# EAGLE design 2s-module (EAGLE 9.6.2)
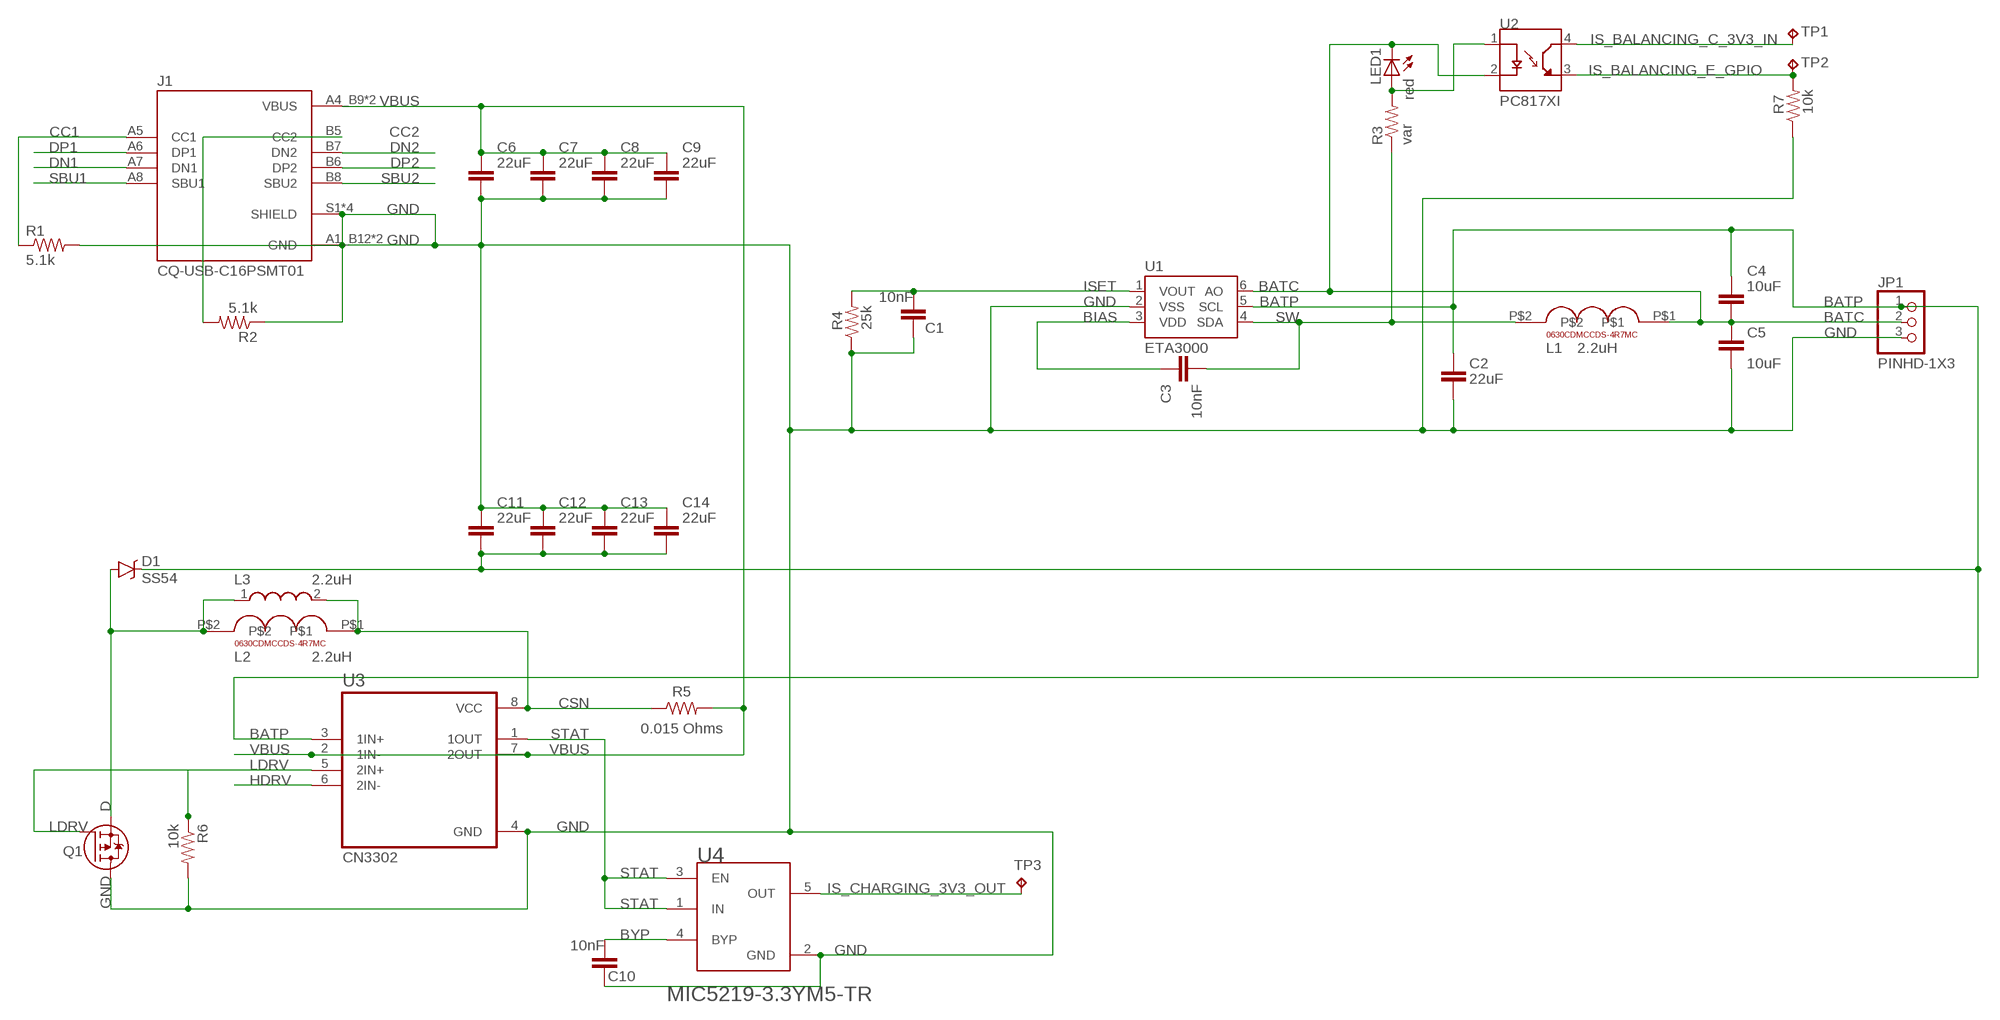
[diagram p0: schematic, sheet 1]

## Parts
C1  10nF  C_CHIP-0603(1608-METRIC)  [CAPC1608X85]
C2  22uF  C_CHIP-1206(3216-METRIC)  [CAPC3216X135]
C3  10nF  C_CHIP-0603(1608-METRIC)  [CAPC1608X85]
C4  10uF  C_CHIP-0603(1608-METRIC)  [CAPC1608X85]
C5  10uF  C_CHIP-0603(1608-METRIC)  [CAPC1608X85]
C6  22uF  C_CHIP-1206(3216-METRIC)  [CAPC3216X135]
C7  22uF  C_CHIP-1206(3216-METRIC)  [CAPC3216X135]
C8  22uF  C_CHIP-1206(3216-METRIC)  [CAPC3216X135]
C9  22uF  C_CHIP-1206(3216-METRIC)  [CAPC3216X135]
C10  10nF  C_CHIP-0603(1608-METRIC)  [CAPC1608X85]
C11  22uF  C_CHIP-1206(3216-METRIC)  [CAPC3216X135]
C12  22uF  C_CHIP-1206(3216-METRIC)  [CAPC3216X135]
C13  22uF  C_CHIP-1206(3216-METRIC)  [CAPC3216X135]
C14  22uF  C_CHIP-1206(3216-METRIC)  [CAPC3216X135]
D1  SS54  [DO-214AC]
J1  CQ-USB-C16PSMT01  [SHENZHEN-CHUANGQIN-TECHNOLOGY_CQ-USB-C16PSMT01]
JP1  PINHD-1X3  [1X03]
L1  0630CDMCCDS-4R7MC  [0630CDMCCDS-4R7MC]
L2  2.2uH  0630CDMCCDS-4R7MC  [0630CDMCCDS-4R7MC]
L3  2.2uH  74437368047  [INDM110100X380N]
LED1  red  LEDCHIPLED_0603  [CHIPLED_0603]
Q1  IRFR9020A  [TO252]
R1  5.1k  R-US_R0603  [R0603]
R2  5.1k  R-US_R0603  [R0603]
R3  var  R-US_R0603  [R0603]
R4  25k  R-US_R0603  [R0603]
R5  0.015 Ohms  R-US_CHIP-2512(6332-METRIC)  [RESC6332X71]
R6  10k  R-US_R0603  [R0603]
R7  10k  R-US_R0603  [R0603]
TP1  TPB1,27  [B1,27]
TP2  TPB1,27  [B1,27]
TP3  TPB1,27  [B1,27]
U1  MCP4725  MCP4725SOT-23  [SOT23-6]
U2  PC817XI  [SOIC254P975X460-4N]
U3  LM393DR  [SOIC127P599X175-8N]
U4  MICROCHIP_MIC5219-3_3YM5-TRMICROCHIP_MIC5219-3_3YM5-TR_0_0  [MICROCHIP_MIC5219-3_3YM5-TR_0]

## Nets
BATC: C4.2 C5.1 JP1.2 L1.P$1 LED1.C U1.6(AO) U2.2(C)
BATP: C2.1 C4.1 C11.2 C12.2 C13.2 C14.2 D1.C JP1.1 U1.5(SCL) U3.3(1IN+)
BIAS: C3.2 U1.3(VDD)
BYP: C10.2 U4.4(BYP)
CC1: J1.A5(CC1) R1.1
CC2: J1.B5(CC2) R2.2
CSN: L2.P$1 L3.2 R5.1 U3.8(VCC)
D: D1.A L2.P$2 L3.1 Q1.2(S)
DN1: J1.A7(DN1)
DN2: J1.B7(DN2)
DP1: J1.A6(DP1)
DP2: J1.B6(DP2)
GND: C1.1 C2.2 C5.2 C6.2 C7.2 C8.2 C9.2 C10.1 C11.1 C12.1 C13.1 C14.1 J1.A1_B12(GND) J1.B1_A12(GND) J1.S1(SHIELD) J1.S2(SHIELD) J1.S3(SHIELD) J1.S4(SHIELD) JP1.3 Q1.3(D) R1.2 R2.1 R4.1 R6.2 R7.1 U1.2(VSS) U3.4(GND) U4.2(GND)
HDRV: U3.6(2IN-)
IS_BALANCING_C_3V3_IN: TP1.TP U2.4(CT)
IS_BALANCING_E_GPIO: R7.2 TP2.TP U2.3(ET)
IS_CHARGING_3V3_OUT: TP3.TP U4.5(OUT)
ISET: C1.2 R4.2 U1.1(VOUT)
LDRV: Q1.1(G) R6.1 U3.5(2IN+)
N$1: LED1.A R3.2 U2.1(A)
SBU1: J1.A8(SBU1)
SBU2: J1.B8(SBU2)
STAT: U3.1(1OUT) U4.1(IN) U4.3(EN)
SW: C3.1 L1.P$2 R3.1 U1.4(SDA)
VBUS: C6.1 C7.1 C8.1 C9.1 J1.A4_B9(VBUS) J1.B4_A9(VBUS) R5.2 U3.2(1IN-) U3.7(2OUT)

## Notes on the sheet
- ETA3000 | L1 | 2.2uH
- L2 | 2.2uH
- CN3302

## Library data of the parts
C1-C14 = Capacitor:C: Capacitor - Generic; CATEGORY: Capacitor
D1 = SS54:SS54: SCHOTTKY DIODES 40Vpeak, 28Vrms 5A (SBD) SMA(DO-214AC) Check availability <https://pricing.snapeda.com/parts/SS54/MDD/view-part?ref=eda>; AVAILABILITY: In Stock; CHECK_PRICES: https://www.snapeda.com/parts/SS54/MDD/view-part/?ref=eda; DESCRIPTION: Diode Schottky 40 V 5A Surface Mount SMA; MF: MDD; MP: SS54; PACKAGE: None; PRICE: None; PURCHASE-URL: https://www.snapeda.com/api/url_track_click_mouser/?unipart_id=12137997&manufacturer=MDD&part_name=SS54&search_term=None; SNAPEDA_LINK: https://www.snapeda.com/parts/SS54/MDD/view-part/?ref=snap
J1 = CQ-USB-C16PSMT01:CQ-USB-C16PSMT01: C Type USB Type-C Female Plug 16 Pin Connector Power Charger Jack Port Check availability <https://pricing.snapeda.com/parts/CQ-USB-C16PSMT01/Shenzen%20Chuangqin%20Technology/view-part?ref=eda>; AVAILABILITY: Not in stock; DESCRIPTION: C Type USB Type-C Female Plug 16 Pin Connector Power Charger Jack Port; MF: Shenzen Chuangqin Technology; MP: CQ-USB-C16PSMT01; PACKAGE: Package; PRICE: None
JP1 = Connector:PINHD-1X3: PIN HEADER; CATEGORY: Headers; DESCRIPTION: Header, Straight, 3 Position; MANUFACTURER: Generic; MPN: Generic; OPERATING_TEMPERATURE: Generic; PART_STATUS: Active; PITCH: 0.100" (2.54mm); ROHS_COMPLIANCE: Generic; SERIES: Generic; SUB-CATEGORY: Headers, Male Pins; TYPE: Board to Board or Cable, Unshrouded, Through Hole, Straight
L1 L2 = 0630CDMCCDS-4R7MC:0630CDMCCDS-4R7MC: Check availability <https://pricing.snapeda.com/parts/0630CDMCCDS-4R7MC/Sumida/view-part?ref=eda>; AVAILABILITY: In Stock; CHECK_PRICES: https://www.snapeda.com/parts/0630CDMCCDS-4R7MC/Sumida/view-part/?ref=eda; DESCRIPTION: 4.7 µH Shielded Molded Inductor 6.3 A 33mOhm Max Nonstandard; MF: Sumida; MP: 0630CDMCCDS-4R7MC; PACKAGE: Nonstandard Sumida; PRICE: None; PURCHASE-URL: https://www.snapeda.com/api/url_track_click_mouser/?unipart_id=1647434&manufacturer=Sumida&part_name=0630CDMCCDS-4R7MC&search_term=0630; SNAPEDA_LINK: https://www.snapeda.com/parts/0630CDMCCDS-4R7MC/Sumida/view-part/?ref=snap
L3 = 74437368047:74437368047: LHMI Inductor 1040 4.7uH 7.0A 15.5mOhm Check availability <https://pricing.snapeda.com/parts/74437368047/Wurth%20Electronics/view-part?ref=eda>; AVAILABILITY: In Stock; CHECK_PRICES: https://www.snapeda.com/parts/74437368047/Wurth+Electronics+Inc./view-part/?ref=eda; DESCRIPTION: 4.7 µH Shielded Molded Inductor 7 A 15.5mOhm Max Nonstandard; MF: Wurth Electronics; MP: 74437368047; PACKAGE: Nonstandard Wurth Electronics; PRICE: None; SNAPEDA_LINK: https://www.snapeda.com/parts/74437368047/Wurth+Electronics+Inc./view-part/?ref=snap
LED1 = adafruit:LED: LED OSRAM: - CHIPLED LG R971, LG N971, LY N971, LG Q971, LY Q971, LO R971, LY R971 LH N974, LH R974 LS Q976, LO Q976, LY Q976 LO Q996 - Hyper CHIPLED LW Q18S LB Q993, LB Q99A, LB R99A - SideLED LS A670, LO A670, LY A670, LG A670, LP A670 LB A673, LV A673, LT A673, LW A673 LH A674 LY A675 LS A676, LA A676, LO A676, LY A676, LW A676 LS A679, LY A679, LG A679 - Hyper Micro SIDELED® LS Y876, LA Y876, LO Y876, LY Y876 LT Y87S - SmartLED LW L88C, LW L88S LB L89C, LB L89S, LG L890 LS L89K, LO L89K, LY L89K LS L896, LA L896, LO L896, LY L896 - TOPLED LS T670, LO T670, LY T670, LG T670, LP T670 LSG T670, LSP T670, LSY T670, LOP T670, LYG T670 LG T671, LOG T671, LSG T671 LB T673, LV T673, LT T673, LW T673 LH T674 LS T676, LA T676, LO T676, LY T676, LB T676, LH T676, LSB T676, LW T676 LB T67C, LV T67C, LT T67C, LS T67K, LO T67K, LY T67K, LW E67C LS E67B, LA E67B, LO E67B, LY E67B, LB E67C, LV E67C, LT E67C LW T67C LS T679, LY T679, LG T679 LS T770, LO T770, LY T770, LG T770, LP T770 LB T773, LV T773, LT T773, LW T773 LH T774 LS E675, LA E675, LY E675, LS T675 LS T776, LA T776, LO T776, LY T776, LB T776 LHGB T686 LT T68C, LB T68C - Hyper Mini TOPLED® LB M676 - Mini TOPLED Santana® LG M470 LS M47K, LO M47K, LY M47K Source: http://www.osram.convergy.de/
Q1 = semiconductor:IRFR9020: P-Channel FET IRFR9020A 50V 9.9A 0.28ohm 42W -50 to 150°C TO252 / DPAK SMD
R1-R4 R6 R7 = resistor:R-US_: RESISTOR, American symbol
R5 = Resistor:R-US: Resistor Fixed - ANSI; CATEGORY: Resistor; SUB-CATEGORY: Fixed
TP1-TP3 = BeagleBone_Blue_R3:TP: Test pad
U1 = SparkFun-IC-Conversion:MCP4725: MCP4725 DAC Microchip 12-bit I2C DAC, SOT23-6 Datasheet <https://cdn.sparkfun.com/datasheets/BreakoutBoards/MCP4725_2009.pdf> SparkFun Products SparkFun I2C DAC Breakout - MCP4725 <https://www.sparkfun.com/products/12918> (BOB-12918); PROD_ID: IC-08886
U2 = PC817XI:PC817XI: Semiconductors and Actives, Optocouplers/Optoisolators, trans, Optoelectronics, smd Check availability <https://pricing.snapeda.com/parts/PC817XI/Sharp%20Microelectronics/view-part?ref=eda>; AVAILABILITY: In Stock; CHECK_PRICES: https://www.snapeda.com/parts/PC817XI/Sharp+Microelectronics/view-part/?ref=eda; DESCRIPTION: Optoisolator Transistor Output 5000Vrms 1 Channel 4-SMD; MF: Sharp Microelectronics; MP: PC817XI; PACKAGE: SMD-4 Sharp Microelectronics; PRICE: None; PURCHASE-URL: https://www.snapeda.com/api/url_track_click_mouser/?unipart_id=494182&manufacturer=Sharp Microelectronics&part_name=PC817XI&search_term=pc817; SNAPEDA_LINK: https://www.snapeda.com/parts/PC817XI/Sharp+Microelectronics/view-part/?ref=snap
U3 = LM393DR:LM393DR: Check availability <https://pricing.snapeda.com/parts/LM393DR/Texas%20Instruments/view-part?ref=eda>; AVAILABILITY: In Stock; CHECK_PRICES: https://www.snapeda.com/parts/LM393DR/Texas+Instruments/view-part/?ref=eda; DESCRIPTION: Dual differential comparator, commercial grade; MF: Texas Instruments; MP: LM393DR; PACKAGE: SOIC-8 Texas Instruments; PRICE: None; PURCHASE-URL: https://www.snapeda.com/api/url_track_click_mouser/?unipart_id=6437&manufacturer=Texas Instruments&part_name=LM393DR&search_term=lm393dr; SNAPEDA_LINK: https://www.snapeda.com/parts/LM393DR/Texas+Instruments/view-part/?ref=snap
U4 = Microchip - MIC5219-3.3YM5-TR:MICROCHIP_MIC5219-3_3YM5-TR: MIC5219-3.3YM5-TR Linear Voltage Regulator IC 1 Output 500mA SOT-23-5; ACCURACY_PERCENTAGE: 1%; AMBIENT_TEMPERATURE_RANGE_HIGH: +125°C; AMBIENT_TEMPERATURE_RANGE_LOW: -40°C; AUTOMOTIVE: No; CENTROID_NOT_SPECIFIED: No; DATASHEET: http://ww1.microchip.com/downloads/en/DeviceDoc/MIC5219-500mA-Peak-Output-LDO-Regulator-DS20006021A.pdf; DEVICE_CLASS_L1: Integrated Circuits (ICs); DEVICE_CLASS_L2: Power Management ICs; DEVICE_CLASS_L3: Voltage Regulators - Linear; DIGIKEY_DESCRIPTION: IC REG LINEAR 3.3V 500MA SOT23-5; DIGIKEY_PART_NUMBER: 576-1281-1-ND; DROPOUT_VOLTAGE: 350mV; FOOTPRINT_PARAMETERS_1: {"fp_type":"SOT23","params":{"N":{"default":"5","long name":"Number of leads","type":"multichoice","short name":"N"},"A":{"nom":false,"long name":"Height","min":900000,"max":1450000,"short name":"A","type":"measurement"},"A1":{"nom":false,"long name":"Package clearance","min":0,"max":150000,"short name":"A1","type":"measurement"},"A2":{"nom":1100000,"long name":"Package height","min":900000,"max":1300000,"short name":"A2","type":"measurement"},"D":{"nom":2900000,"long name":"Package length","min":2800000,"max":3000000,"short name":"D","type":"measurement"},"E":{"nom":2800000,"long name":"Width /w leads","min":2600000,"max":3000000,"short name":"E","type":"measurement"},"E1":{"nom":1600000,"long name":"Package width","min":1500000,"max":1700000,"short name":"E1","type":"measurement"},"B":{"nom":false,"long name":"Lead width","min":250000,"max":500000,"short name":"B","type":"measurement"},"C":{"nom":false,"long name":"Lead thickness","min":90000,"max":200000,"short name":"C","type":"measurement"},"L":{"nom":450000,"long name":"Lead foot length","min":350000,"max":550000,"short name":"L","type":"measurement"},"e":{"nom":950000,"long name":"Lead pitch","min":null,"max":null,"short name":"e","type":"measurement"},"PHI":{"nom":false,"long name":"Lead angle","min":0,"max":3000000,"short name":"PHI","type":"measurement"},"offset x":{"nom":0,"long name":"X Center offset","min":null,"max":null,"short name":"offset x","type":"measurement"},"offset y":{"nom":0,"long name":"Y Center offset","min":null,"max":null,"short name":"offset y","type":"measurement"},"LS":{"default":"Rounded rectangle","long name":"Land shape","type":"multichoice","short name":"LS"},"LS1":{"default":"Rectangle","long name":"Land shape (Pin 1)","type":"multichoice","short name":"LS1"},"solder toe":{"nom":550000,"long name":"Solder fillet (toe)","min":null,"max":null,"short name":"solder toe","type":"fixedmeasurement"},"solder heel":{"nom":450000,"long name":"Solder fillet (heel)","min":null,"max":null,"short name":"solder heel","type":"fixedmeasurement"},"solder side":{"nom":50000,"long name":"Solder fillet (side)","min":null,"max":null,"short name":"solder side","type":"fixedmeasurement"},"courtyard":{"nom":500000,"long name":"Courtyard","min":null,"max":null,"short name":"courtyard","type":"fixedmeasurement"},"SF":{"default":"A","long name":"Packing level","type":"multichoiceparent","short name":"SF","help":"http://support.upverter.com/customer/portal/articles/978783-what-is-a-footprint-packing-level","children":["solder toe","solder heel","solder side","courtyard"]}}}; FOOTPRINT_PARAMETERS_2: {"fp_type":"SOT23","params":{"N":{"default":"5","long name":"Number of leads","type":"multichoice","short name":"N"},"A":{"nom":false,"long name":"Height","min":900000,"max":1450000,"short name":"A","type":"measurement"},"A1":{"nom":false,"long name":"Package clearance","min":0,"max":150000,"short name":"A1","type":"measurement"},"A2":{"nom":1100000,"long name":"Package height","min":900000,"max":1300000,"short name":"A2","type":"measurement"},"D":{"nom":2900000,"long name":"Package length","min":2800000,"max":3000000,"short name":"D","type":"measurement"},"E":{"nom":2800000,"long name":"Width /w leads","min":2600000,"max":3000000,"short name":"E","type":"measurement"},"E1":{"nom":1600000,"long name":"Package width","min":1500000,"max":1700000,"short name":"E1","type":"measurement"},"B":{"nom":false,"long name":"Lead width","min":250000,"max":500000,"short name":"B","type":"measurement"},"C":{"nom":false,"long name":"Lead thickness","min":90000,"max":200000,"short name":"C","type":"measurement"},"L":{"nom":450000,"long name":"Lead foot length","min":350000,"max":550000,"short name":"L","type":"measurement"},"e":{"nom":950000,"long name":"Lead pitch","min":null,"max":null,"short name":"e","type":"measurement"},"PHI":{"nom":false,"long name":"Lead angle","min":0,"max":3000000,"short name":"PHI","type":"measurement"},"offset x":{"nom":0,"long name":"X Center offset","min":null,"max":null,"short name":"offset x","type":"measurement"},"offset y":{"nom":0,"long name":"Y Center offset","min":null,"max":null,"short name":"offset y","type":"measurement"},"LS":{"default":"Rounded rectangle","long name":"Land shape","type":"multichoice","short name":"LS"},"LS1":{"default":"Rectangle","long name":"Land shape (Pin 1)","type":"multichoice","short name":"LS1"},"solder toe":{"nom":350000,"long name":"Solder fillet (toe)","min":null,"max":null,"short name":"solder toe","type":"fixedmeasurement"},"solder heel":{"nom":350000,"long name":"Solder fillet (heel)","min":null,"max":null,"short name":"solder heel","type":"fixedmeasurement"},"solder side":{"nom":30000,"long name":"Solder fillet (side)","min":null,"max":null,"short name":"solder side","type":"fixedmeasurement"},"courtyard":{"nom":250000,"long name":"Courtyard","min":null,"max":null,"short name":"courtyard","type":"fixedmeasurement"},"SF":{"default":"B","long name":"Packing level","type":"multichoiceparent","short name":"SF","help":"http://support.upverter.com/customer/portal/articles/978783-what-is-a-footprint-packing-level","children":["solder toe","solder heel","solder side","courtyard"]}}}; FOOTPRINT_PARAMETERS_3: {"fp_type":"SOT23","params":{"N":{"default":"5","long name":"Number of leads","type":"multichoice","short name":"N"},"A":{"nom":false,"long name":"Height","min":900000,"max":1450000,"short name":"A","type":"measurement"},"A1":{"nom":false,"long name":"Package clearance","min":0,"max":150000,"short name":"A1","type":"measurement"},"A2":{"nom":1100000,"long name":"Package height","min":900000,"max":1300000,"short name":"A2","type":"measurement"},"D":{"nom":2900000,"long name":"Package length","min":2800000,"max":3000000,"short name":"D","type":"measurement"},"E":{"nom":2800000,"long name":"Width /w leads","min":2600000,"max":3000000,"short name":"E","type":"measurement"},"E1":{"nom":1600000,"long name":"Package width","min":1500000,"max":1700000,"short name":"E1","type":"measurement"},"B":{"nom":false,"long name":"Lead width","min":250000,"max":500000,"short name":"B","type":"measurement"},"C":{"nom":false,"long name":"Lead thickness","min":90000,"max":200000,"short name":"C","type":"measurement"},"L":{"nom":450000,"long name":"Lead foot length","min":350000,"max":550000,"short name":"L","type":"measurement"},"e":{"nom":950000,"long name":"Lead pitch","min":null,"max":null,"short name":"e","type":"measurement"},"PHI":{"nom":false,"long name":"Lead angle","min":0,"max":3000000,"short name":"PHI","type":"measurement"},"offset x":{"nom":0,"long name":"X Center offset","min":null,"max":null,"short name":"offset x","type":"measurement"},"offset y":{"nom":0,"long name":"Y Center offset","min":null,"max":null,"short name":"offset y","type":"measurement"},"LS":{"default":"Rounded rectangle","long name":"Land shape","type":"multichoice","short name":"LS"},"LS1":{"default":"Rectangle","long name":"Land shape (Pin 1)","type":"multichoice","short name":"LS1"},"solder toe":{"nom":150000,"long name":"Solder fillet (toe)","min":null,"max":null,"short name":"solder toe","type":"fixedmeasurement"},"solder heel":{"nom":250000,"long name":"Solder fillet (heel)","min":null,"max":null,"short name":"solder heel","type":"fixedmeasurement"},"solder side":{"nom":10000,"long name":"Solder fillet (side)","min":null,"max":null,"short name":"solder side","type":"fixedmeasurement"},"courtyard":{"nom":100000,"long name":"Courtyard","min":null,"max":null,"short name":"courtyard","type":"fixedmeasurement"},"SF":{"default":"C","long name":"Packing level","type":"multichoiceparent","short name":"SF","help":"http://support.upverter.com/customer/portal/articles/978783-what-is-a-footprint-packing-level","children":["solder toe","solder heel","solder side","courtyard"]}}}; FOOTPRINT_VARIANT_NAME_0: Recommended_Land_Pattern; FOOTPRINT_VARIANT_NAME_1: IPC_A; FOOTPRINT_VARIANT_NAME_2: IPC_B; FOOTPRINT_VARIANT_NAME_3: IPC_C; HEIGHT: 1.45mm; LEAD_FREE: yes; MAX_JUNCTION_TEMP: +125°C; MAX_SUPPLY_VOLTAGE: 12V; MF: Microchip; MFG_PACKAGE_IDENT: SOT23-5LD-PL-1; MFG_PACKAGE_IDENT_COMPONENT_ID: 354a25971f54c3a5; MFG_PACKAGE_IDENT_DATE: 0; MFG_PACKAGE_IDENT_REV: 0; MIN_SUPPLY_VOLTAGE: 2.5V; MOUSER_PART_NUMBER: 998-MIC5219-3.3YM5TR; MPN: MIC5219-3.3YM5-TR; NOMINAL_SUPPLY_CURRENT: 0.1-12000uA; NUMBER_OF_OUTPUTS: 1; OUTPUT_CURRENT: 500mA; OUTPUT_TYPE: Fixed; OUTPUT_VOLTAGE: 3.3V; PACKAGE: SOT-23-5; PREFIX: U; ROHS: Yes; STANDOFF_HEIGHT: 0mm; TEMPERATURE_RANGE_HIGH: +125°C; TEMPERATURE_RANGE_LOW: -40°C; VERIFICATION_VERSION: 0.0.0.3

## Board
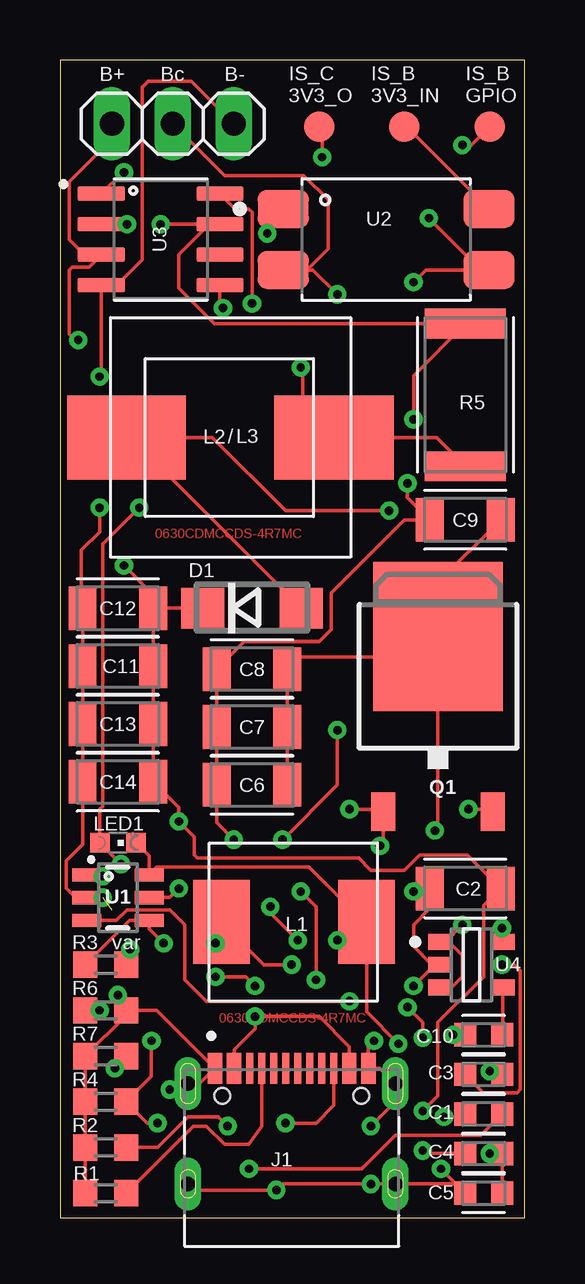
[diagram p1: board, top side]
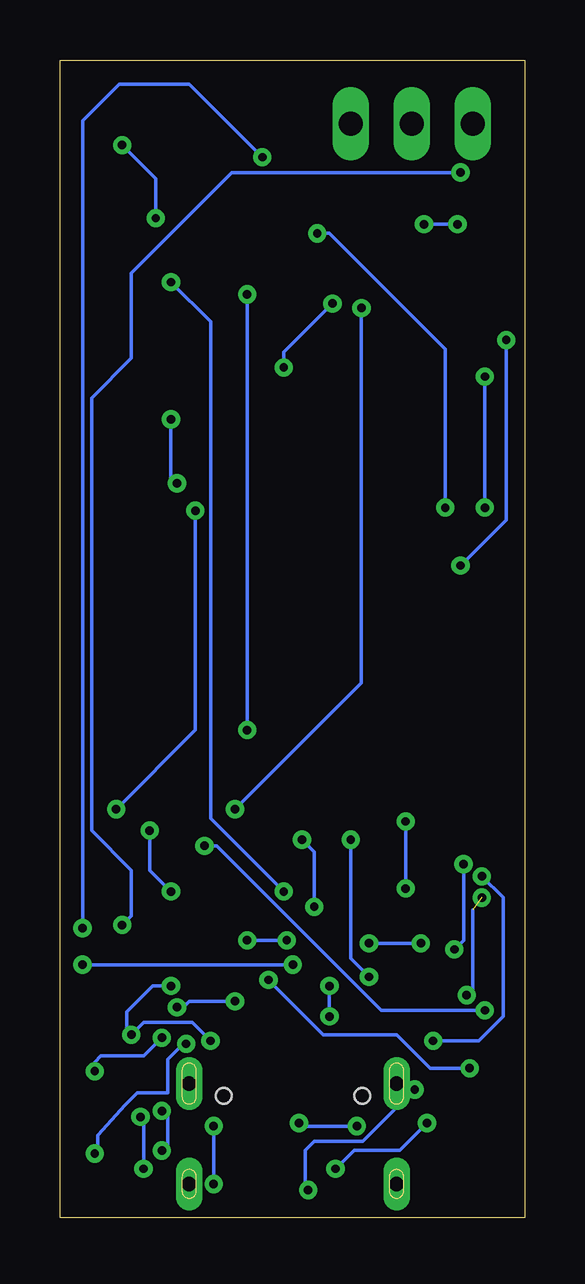
[diagram p2: board, bottom side, seen from below]

Size 19.36 x 48.25 mm. Coordinates in mm from the lower left corner, seen from the top.
Outline: 0,0 19.36,0 19.36,48.25 0,48.25 0,0
Copper layers (1*16): Top 0.035mm / dielectric 1.5mm / Bottom 0.035mm
Design rules "default *": minimum track width 6mil, minimum drill 0.35mm, track to track 6mil, track to pad 6mil, pad to pad 6mil, via to via 6mil, smd to smd 6mil, copper to edge 40mil, drill to drill 6mil, minimum pad ring 10mil, minimum via ring 8mil, stop-mask expansion 4mil, vias tented up to drill 20mil, thermal gap 10mil

### Footprints (pad centres in the part's own frame; a part is rotated, then mirrored left to right if it is on the bottom)
CAPC1608X85 = smd 0.921 x 0.97: 1 -0.775,0; 2 0.775,0
CAPC3216X135 = smd 1.165 x 1.815: 1 -1.475,0; 2 1.475,0
DO-214AC = smd 1.8 x 1.7: A 2.05,0; C -2.05,0
SHENZHEN-CHUANGQIN-TECHNOLOGY_CQ-USB-C16PSMT01 = smd 0.6 x 1.3: A1_B12 -3.2,0; A4_B9 -2.4,0; B1_A12 3.2,0; B4_A9 2.4,0 | smd 0.3 x 1.3: A5 -1.25,0; A6 -0.25,0; A7 0.25,0; A8 1.25,0; B5 1.75,0; B6 0.75,0; B7 -0.75,0; B8 -1.75,0 | drill 0.6 pad 1.05 long: S1 -4.32,-0.64; S2 4.32,-0.64 | drill 0.6 pad 0.8 long: S3 -4.32,-4.82; S4 4.32,-4.82 | hole 0.65: -2.89,-1.14; 2.89,-1.14
1X03 = drill 1.016 long: 1 -2.54,0; 2 0,0; 3 2.54,0
0630CDMCCDS-4R7MC = smd 2.35 x 3.5: P$1 6.55,3.3; P$2 0.5,3.3
INDM110100X380N = smd 4.1 x 3.5: 1 -4.75,0; 2 4.75,0
CHIPLED_0603 = smd 0.8 x 0.8: A 0,-0.75; C 0,0.75
TO252 = smd 1 x 1.6: 1 -2.28,-4.8; 2 2.28,-4.8 | smd 5.4 x 6.2: 3 0,2.5
R0603 = smd 1 x 1.1: 1 -0.85,0; 2 0.85,0
RESC6332X71 = smd 1.231 x 3.37: 1 -2.97,0; 2 2.97,0
B1,27 = smd 1.27 x 1.27: TP 0,0
SOT23-6 = smd 0.55 x 1.2: 1 0.95,1.3; 2 0,1.3; 3 -0.95,1.3; 4 -0.95,-1.3; 5 0,-1.3; 6 0.95,-1.3
SOIC254P975X460-4N = smd 2.13 x 1.57: 1 -4.29,1.27; 2 -4.29,-1.27; 3 4.29,-1.27; 4 4.29,1.27
SOIC127P599X175-8N = smd 1.97 x 0.6: 1 -2.47,1.905; 2 -2.47,0.635; 3 -2.47,-0.635; 4 -2.47,-1.905; 5 2.47,-1.905; 6 2.47,-0.635; 7 2.47,0.635; 8 2.47,1.905
MICROCHIP_MIC5219-3_3YM5-TR_0 = smd 1 x 0.66: 1 -1.3,0.95; 2 -1.3,0; 3 -1.3,-0.95; 4 1.3,-0.95; 5 1.3,0.95

### Placement (x,y rotation side)
C1  17.65,4.32 0 top
C2  16.89,13.72 180 top
C3  17.65,5.97 0 top
C4  17.65,2.67 0 top
C5  17.65,1.02 180 top
C6  8,18.03 0 top
C7  8,20.45 0 top
C8  8,22.86 0 top
C9  16.89,29.08 0 top
C10  17.65,7.62 0 top
C11  2.41,22.99 0 top
C12  2.41,25.4 0 top
C13  2.41,20.57 0 top
C14  2.41,18.16 0 top
D1  8,25.4 0 top
J1  9.65,6.22 0 top
JP1  4.7,45.59 0 top
L1  6.22,9.02 0 top
L2  3.56,29.21 0 top
L3  7.11,32.51 0 top
LED1  2.41,15.62 270 top
Q1  15.75,21.72 0 top
R1  1.9,1.02 180 top
R2  1.9,2.92 0 top
R3  1.9,10.54 0 top
R4  1.9,4.83 0 top
R5  16.89,34.29 90 top
R6  1.9,8.64 0 top
R7  1.9,6.73 0 top
TP1  14.35,45.47 0 top
TP2  17.91,45.47 0 top
TP3  10.79,45.47 0 top
U1  2.41,13.34 90 top
U2  13.59,40.77 0 top
U3  4.19,40.77 0 top
U4  17.14,10.54 0 top

### Tracks (layer width: path | path; a pad name or v marks a point on that pad's centre or on a via)
BATC  (via drill 0.35)
  Top 0.152: JP1.2 6.86,43.43 10.16,43.43 11.18,42.42 11.18,40.39 10.29,39.5 U2.2 10.54,39.5 v11.56,38.48 | L1.P$1 12.77,12.19 | 12.77,12.19 12.77,8.56 v14.1,7.24 | v17.91,2.67 C4.2 C5.1 | 12.67,12.29 10.36,14.61 4.03,14.61 U1.6 3.71,15.07 LED1.C | 12.67,12.29 12.77,12.19 | v11.56,20.32 11.56,18.03 v9.27,15.75 | v8.76,12.95 8.76,12.7 v9.91,11.56 | v11.56,11.56 11.94,11.56 12.67,12.29
  Bottom 0.152: v17.91,2.67 17.78,2.67 17.78,3.43 16.64,4.7 16.13,5.21 14.86,5.21 14.86,6.6 14.22,7.24 v14.1,7.24 | v11.56,38.48 v11.56,20.32 | v9.27,15.75 8.76,15.24 v8.76,12.95 | v9.91,11.56 v11.56,11.56
BATP  (via drill 0.35)
  Top 0.152: C4.1 15.24,2.67 v15.11,2.79 | v15.11,4.45 15.75,5.08 15.75,8.13 17.65,10.03 17.65,13 C2.1 16.97,15.11 14.99,15.11 14.35,14.48 12.95,14.48 12.45,14.99 5.71,14.99 5.59,15.11 5.59,15.88 v4.95,16.51 4.95,17.1 C14.2 C13.2 C11.2 C12.2 | JP1.1 2.16,44.96 0.38,43.18 0.38,40.77 1.02,40.13 U3.3 1.21,39.62 0.51,39.62 0.38,39.5 0.38,36.83 0.64,36.58 v0.76,36.58 | v2.67,27.18 3.89,25.96 C12.2 | C12.2 D1.C | v4.95,13.72 4.57,13.34 U1.5
  Bottom 0.152: v15.11,4.45 14.86,4.19 14.86,3.05 v15.11,2.79 | v0.76,36.58 0.76,29.08 v2.67,27.18 | v4.95,13.72 v4.95,16.51
BIAS  (via drill 0.35)
  Top 0.152: U1.3 2.35,12.38 2.79,12.83 4.57,12.83 5.21,12.19 5.21,9.91 6.1,9.02 v12.07,9.02 | v14.48,8.76 15.11,8.13 v15.11,7.49 | v17.91,6.1 18.3,6.1 C3.2
  Bottom 0.152: v12.07,9.02 13.97,9.02 14.35,8.64 v14.48,8.76 | v15.11,7.49 15.88,6.73 17.65,6.73 17.91,6.48 v17.91,6.1
BYP
  Top 0.152: U4.4 18.45,7.64 C10.2
CC1
  Top 0.152: R1.1 5.55,3.81 6.1,3.81 6.86,3.05 7.87,3.05 8.4,3.81 J1.A5
CC2  (via drill 0.35)
  Top 0.152: R2.2 4.06,2.92 5.33,4.19 6.6,4.19 v6.98,3.81 | v9.4,3.94 10.67,3.94 11.4,4.67 J1.B5
  Bottom 0.152: v6.98,3.81 9.27,3.81 v9.4,3.94
CSN  (via drill 0.35)
  Top 0.152: R5.1 15.7,32.51 12.07,32.51 L3.2 L2.P$1 10.11,35.36 v10.03,35.43 | U3.8 7.3,42.04 7.87,42.04 8,41.91 v8,38.1
  Bottom 0.152: v8,38.1 10.03,36.07 v10.03,35.43
D  (via drill 0.35)
  Top 0.152: D1.A 2.94,32.51 L3.1 L2.P$2 6.35,32.51 9.4,29.46 v13.72,29.46 | v17.02,17.02 17.93,17.02 Q1.2
  Bottom 0.152: v13.72,29.46 13.72,20.32 v17.02,17.02
GND  (via drill 0.35)  (1 unrouted)
  Top 0.152: R6.2 2.75,8.43 R7.1 R4.1 R2.1 R1.2 | R6.2 4.04,8.64 J1.A1_B12 5.81,5.58 J1.S1 5.08,5.33 v4.57,5.33 | JP1.3 5.46,47.37 3.68,47.37 3.43,47.12 3.43,39.94 2.36,38.86 U3.4 1.72,35.12 v1.65,35.05 | v1.65,29.59 1.65,28.57 0.89,27.81 0.89,25.45 C12.1 C11.1 C13.1 C14.1 0.94,15.54 0.25,14.86 0.25,13.72 0.64,13.34 U1.2 v1.78,13.34 | C2.2 15.42,13.59 | 15.42,13.59 15.42,12.88 14.73,12.19 14.73,11.3 15.49,10.54 15.62,10.54 | v14.73,9.65 15.62,10.54 | 15.62,10.54 U4.2 | v2.41,9.27 2.75,8.93 R6.2 | C1.1 16.75,4.19 v16,4.19 | v15.88,2.03 15.88,2.02 C5.2 16.49,1.4 J1.S4 v12.96,1.4 v12.95,1.4 9.27,1.4 v9.02,1.14 5.59,1.14 J1.S3 | v13.08,7.37 12.85,7.14 J1.B1_A12 13.33,6.22 J1.S2 13.97,4.83 v12.95,3.81 | C10.1 v16.38,7.62 | C6.2 C7.2 C8.2 9.98,23.37 14.9,23.37 Q1.3 | Q1.3 15.75,16.26 v15.62,16.13 | v14.73,13.59 15.42,13.59 | C9.2 15.75,26.46 Q1.3
  Bottom 0.152: v1.65,35.05 v1.65,29.59 | v14.73,9.65 15.49,9.65 16.57,8.57 16.57,7.81 v16.38,7.62 15.88,8.13 13.84,8.13 v13.08,7.37 | 2.16,12.83 2.16,9.53 v2.41,9.27 | v15.88,2.03 15.88,4.06 v16,4.19 | v12.95,1.4 v12.95,3.81 | v15.62,16.13 15.62,14.48 v14.73,13.59 | v4.57,5.33 6.73,3.17 8.76,3.17 9.14,2.79 9.14,1.27 v9.02,1.14
IS_BALANCING_C_3V3_IN
  Top 0.152: U2.4 14.45,45.47 TP1.TP
IS_BALANCING_E_GPIO  (via drill 0.35)
  Top 0.152: TP2.TP 17.14,44.7 v16.76,44.7 | v15.37,41.66 17.53,39.5 | 17.53,39.5 U2.3 | R7.2 2.75,6.69 v2.29,6.22 | v10.67,9.91 10.67,12.95 v10.03,13.59 | v14.73,38.99 15.24,39.5 17.53,39.5
  Bottom 0.152: v16.76,44.7 15.37,43.31 v15.37,41.66 | v2.29,6.22 3.94,6.22 5.33,7.62 8.38,7.62 v10.67,9.91 | v10.03,13.59 13.08,16.64 13.08,37.34 v14.73,38.99
IS_CHARGING_3V3_OUT  (via drill 0.35)
  Top 0.152: U4.5 18.45,12.04 v18.41,12.06 | v10.92,44.2 10.92,45.34 TP3.TP
  Bottom 0.152: v18.41,12.06 18.41,45.72 16.89,47.24 13.97,47.24 v10.92,44.2
ISET  (via drill 0.35)
  Top 0.152: v4.06,3.94 3.64,3.94 R4.2 3.81,5.88 v3.81,7.37 | v7.87,2.03 12.57,2.03 13.97,3.43 17.54,3.43 C1.2 | v1.78,14.22 1.17,14.22 U1.1
  Bottom 0.152: v4.06,3.94 5.2,2.8 7.1,2.8 v7.87,2.03 | v3.81,7.37 1.9,7.37 0.89,8.38 0.89,13.34 v1.78,14.22
LDRV  (via drill 0.35)
  Top 0.152: v13.34,15.49 13.47,15.63 Q1.1 13.37,17.02 v12.07,17.02 | v1.65,8.64 R6.1 | U3.5 6.66,37.92 6.73,37.85 v6.79,37.91
  Bottom 0.152: v13.34,15.49 12.83,15.49 5.97,8.64 v1.65,8.64 | v6.79,37.91 6.79,22.29 v12.07,17.02
N$1  (via drill 0.35)
  Top 0.152: 2.67,10.63 R3.2 2.92,10.71 v2.92,11.18 | v2.54,14.73 2.54,14.74 LED1.A 1.66,17.03 1.78,17.14 1.78,28.07 v3.3,29.59 | U2.1 9.3,41.68 v8.64,41.02
  Bottom 0.152: v2.54,14.73 2.54,11.56 v2.92,11.18 | v3.3,29.59 3.3,36.2 8.13,41.02 v8.64,41.02
STAT  (via drill 0.35)
  Top 0.152: U3.1 2.61,43.56 v2.67,43.56 | v16.76,12.19 16.06,11.49 U4.1 16.2,11.49 16.76,10.92 16.76,10.03 16.32,9.59 U4.3
  Bottom 0.152: v2.67,43.56 12.19,43.56 16.38,39.37 16.38,35.81 18.03,34.16 18.03,16.13 16.38,14.48 16.38,12.57 v16.76,12.19
SW  (via drill 0.35)
  Top 0.152: R3.1 2.9,12.38 U1.4 3.71,12.04 v4.32,11.43 | C3.1 17.64,5.21 19.05,5.21 19.18,5.33 19.18,10.29 18.92,10.54 v18.41,10.54 | v9.65,10.54 8.5,10.54 L1.P$2 6.72,11.68 v6.48,11.43
  Bottom 0.152: v18.41,10.54 v9.65,10.54 | v4.32,11.43 v6.48,11.43
VBUS  (via drill 0.35)
  Top 0.152: v14.73,33.27 14.73,35.1 R5.2 6.43,37.26 4.95,38.73 4.95,40.13 6.22,41.4 U3.7 v4.19,41.4 | v14.48,30.61 14.48,30.02 C9.1 14.35,29.08 11.3,26.04 11.3,24.51 10.79,24 7.67,24 C8.1 C7.1 C6.1 6.53,16.46 v7.24,15.75 | U3.2 v2.79,41.4 | v6.48,10.03 7.75,10.03 v8.13,9.65 | J1.A4_B9 7.25,7 8.13,7.87 v8.13,8.38 10.79,8.38 12.05,7.12 J1.B4_A9
  Bottom 0.152: v14.73,33.27 14.73,30.86 v14.48,30.61 | v2.79,41.4 v4.19,41.4 | v7.24,15.75 7.24,10.79 v6.48,10.03 | v8.13,9.65 v8.13,8.38

### Text on the board
tNames: B+ | Bc | B- | IS_C / 3V3_O | IS_B / 3V3_IN | IS_B / GPIO | L2 | / | L1